# EAGLE design cataclysm-BOTTOM (EAGLE 9.6.1)
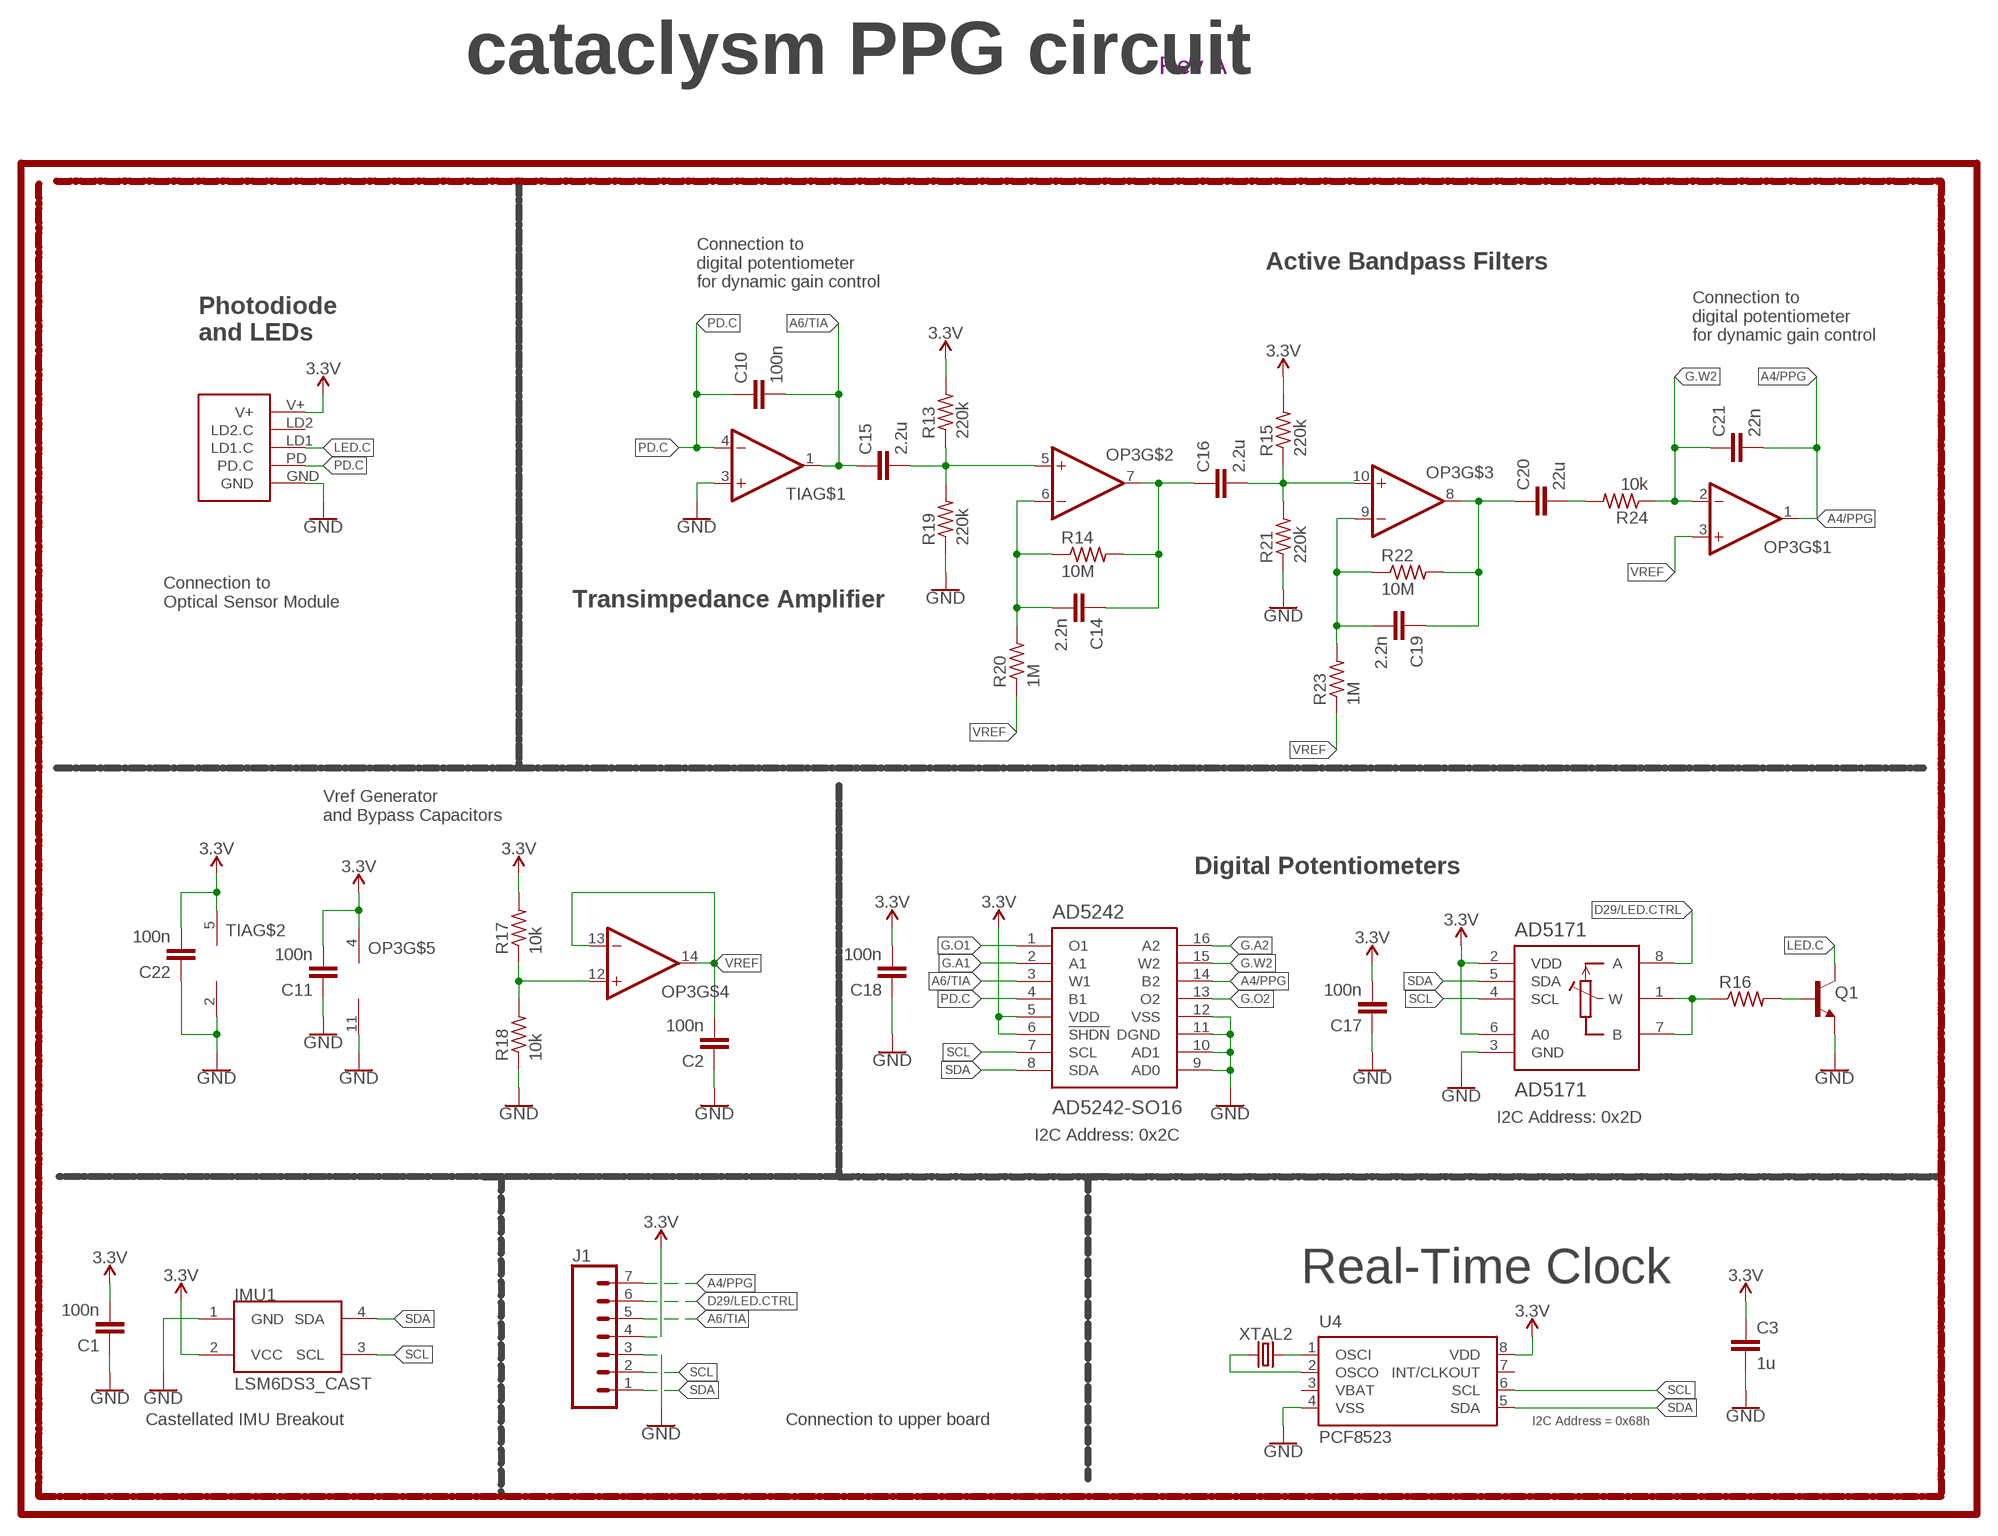
[diagram p0: schematic, sheet 1]

## Parts
AD5171  AD5171  [SOT-23-8]
AD5242  AD5242-SO16  [SO16]
C1  100n  CAPACITOR0603  [C0603]
C2  100n  CAPACITOR0603  [C0603]
C3  1u  CAPACITOR0603  [C0603]
C10  100n  CAPACITOR0603  [C0603]
C11  100n  CAPACITOR0603  [C0603]
C14  2.2n  CAPACITOR0603  [C0603]
C15  2.2u  CAPACITOR0603  [C0603]
C16  2.2u  CAPACITOR0603  [C0603]
C17  100n  CAPACITOR0603  [C0603]
C18  100n  CAPACITOR0603  [C0603]
C19  2.2n  CAPACITOR0603  [C0603]
C20  22u  CAPACITOR0603  [C0603]
C21  22n  CAPACITOR0603  [C0603]
C22  100n  CAPACITOR0603  [C0603]
IMU1  LSM6DS3_CAST  [LSM6DS3_CAST]
J1  CONN_07-1.27MM  [1X07_1.27MM]
LOGO1  REVISION.A  [REV.A]
OP3  OP-QUAD-SO14  [SO14]
Q1  NPN-GENERIC  [SOT23-3]
R13  220k  RESISTOR0603  [R0603]
R14  10M  RESISTOR0603  [R0603]
R15  220k  RESISTOR0603  [R0603]
R16  RESISTOR0603  [R0603]
R17  10k  RESISTOR0402  [R0402]
R18  10k  RESISTOR0402  [R0402]
R19  220k  RESISTOR0603  [R0603]
R20  1M  RESISTOR0603  [R0603]
R21  220k  RESISTOR0603  [R0603]
R22  10M  RESISTOR0603  [R0603]
R23  1M  RESISTOR0603  [R0603]
R24  10k  RESISTOR0603  [R0603]
TIA  OP-SINGLEOT  [SOT23-5]
U4  PCF8523  [SO8]
U$3  PPG.MODULE.2  [PPG.MODULE.2]
XTAL2  32.7680kHz  CRYSTALECS-.327-12.5-12-C-TR  [2-SMD.NOLEAD.2.0MMTO1.2MM]

## Nets
3.3V: AD5171.2(VDD) AD5171.6(A0) AD5242.5(VDD) AD5242.6(!SHDN) C1.2 C3.1 C11.2 C17.2 C18.2 C22.2 IMU1.2(VCC) J1.4 OP3.4(V+) R13.2 R15.2 R17.2 TIA.5(V+) U4.8(VDD) U$3.V+
A4/PPG: AD5242.14(B2) C21.2 J1.7 OP3.1(OUT)
A6/TIA: AD5242.3(W1) C10.2 C15.1 J1.5 TIA.1(OUT)
D29/LED.CTRL: AD5171.8(A) J1.6
G.A1: AD5242.2(A1)
G.A2: AD5242.16(A2)
G.O1: AD5242.1(O1)
G.O2: AD5242.13(O2)
G.W2: AD5242.15(W2) C21.1 OP3.2(-IN) R24.1
GND: AD5171.3(GND) AD5242.9(AD0) AD5242.10(AD1) AD5242.11(DGND) AD5242.12(VSS) C1.1 C2.1 C3.2 C11.1 C17.1 C18.1 C22.1 IMU1.1(GND) J1.3 OP3.11(V-) Q1.2(E) R18.1 R19.1 R21.1 TIA.2(V-) TIA.3(+IN) U4.4(VSS) U$3.GND
LED.C: Q1.3(C) U$3.LD1(LD1.C)
N$1: U4.2(OSCO) XTAL2.P$1
N$8: Q1.1(B) R16.2
N$9: AD5171.1(W) AD5171.7(B) R16.1
N$10: OP3.12(+IN) R17.1 R18.2
N$12: U4.1(OSCI) XTAL2.P$2
N$13: C15.2 OP3.5(+IN) R13.1 R19.2
N$15: C14.2 OP3.6(-IN) R14.1 R20.2
N$16: C14.1 C16.1 OP3.7(OUT) R14.2
N$17: C16.2 OP3.10(+IN) R15.1 R21.2
N$18: C19.2 OP3.9(-IN) R22.1 R23.2
N$19: C19.1 C20.1 OP3.8(OUT) R22.2
N$20: C20.2 R24.2
PD.C: AD5242.4(B1) C10.1 TIA.4(-IN) U$3.PD(PD.C)
SCL: AD5171.4(SCL) AD5242.7(SCL) IMU1.3(SCL) J1.2 U4.6(SCL)
SDA: AD5171.5(SDA) AD5242.8(SDA) IMU1.4(SDA) J1.1 U4.5(SDA)
VREF: C2.2 OP3.3(+IN) OP3.13(-IN) OP3.14(OUT) R20.1 R23.1
Unconnected: U4.7(INT/CLKOUT) U$3.LD2(LD2.C)

## Notes on the sheet
- cataclysm PPG circuit
- Active Bandpass Filters
- Connection to
  digital potentiometer
  for dynamic gain control
- Photodiode
  and LEDs
- Connection to
  digital potentiometer
  for dynamic gain control
- Connection to 
  Optical Sensor Module
- Transimpedance Amplifier
- Vref Generator 
  and Bypass Capacitors
- Digital Potentiometers
- I2C Address: 0x2D
- I2C Address: 0x2C
- Real-Time Clock
- Castellated IMU Breakout | Connection to upper board | I2C Address = 0x68h

## Power pins joined to a net without a drawn wire
VBAT: U4.3(VBAT)

## Library data of the parts
AD5171 = LinnesLab-DigitalIC:AD5171
AD5242 = LinnesLab-DigitalIC:AD5242
C1-C3 C10 C11 C14-C22 = LinnesLab-Passives:CAPACITOR
IMU1 = LinnesLab-Sensors:LSM6DS3_CAST
J1 = LinnesLab-Connectors:CONN_07: Multi connection point. Often used as Generic Header-pin footprint for 0.1 inch spaced/style header connections On any of the 0.1 inch spaced packages, you can populate with these: Break Away Headers - Straight <https://www.sparkfun.com/products/116> (PRT-00116) Break Away Male Headers - Right Angle <https://www.sparkfun.com/products/553> (PRT-00553) Female Headers <https://www.sparkfun.com/products/115> (PRT-00115) Break Away Headers - Machine Pin <https://www.sparkfun.com/products/117> (PRT-00117) Break Away Female Headers - Swiss Machine Pin <https://www.sparkfun.com/products/743> (PRT-00743) For SCREWTERMINALS and SPRING TERMINALS visit here: Screw Terimnals on SparkFun.com <https://www.sparkfun.com/search/results?term=Screw+Terminals> (5mm/3.5mm/2.54mm spacing) This device is also useful as a general connection point to wire up your design to another part of your project. Our various solder wires solder well into these plated through hole pads. Hook-Up Wire - Assortment (Stranded, 22 AWG) <https://www.sparkfun.com/products/11375> (PRT-11375) Hook-Up Wire - Assortment (Solid Core, 22 AWG) <https://www.sparkfun.com/products/11367> (PRT-11367) View the entire wire category on our website here <https://www.sparkfun.com/categories/141> Special notes: Molex polarized connector foot print use with SKU : PRT-08231 with associated crimp pins and housings. 1MM SMD Version SKU: PRT-10208 NOTES ON THE VARIANTS LOCK and LOCK_LONGPADS... This footprint was designed to help hold the alignment of a through-hole component (i.e. 6-pin header) while soldering it into place. You may notice that each hole has been shifted either up or down by 0.005 of an inch from it's more standard position (which is a perfectly straight line). This slight alteration caused the pins (the squares in the middle) to touch the edges of the holes. Because they are alternating, it causes a "brace" to hold the component in place. 0.005 has proven to be the perfect amount of "off-center" position when using our standard breakaway headers. Although looks a little odd when you look at the bare footprint, once you have a header in there, the alteration is very hard to notice. Also,if you push a header all the way into place, it is covered up entirely on the bottom side.
LOGO1 = LinnesLab-Logos:REVISION.A
OP3 = LinnesLab-AnalogIC:OP-QUAD: General symbol and footprints for Quad Op Amps. Use with any standard general purpose op amp.
Q1 = LinnesLab-DiscreteSemi:NPN
R13-R24 = LinnesLab-Passives:RESISTOR
TIA = LinnesLab-AnalogIC:OP-SINGLE: Single Op Amp 2.7V to 6.0V Single Supply CMOS Source: http://ww1.microchip.com/downloads/en/DeviceDoc/21314g.pdf
U4 = LinnesLab-Clocks:PCF8523; DIGIKEY: 568-5306-1-ND; I2C_ADDRESS: 0x68h; MFN: PCF8523T/1,118; MFN_MANUFACTURER: NXP USA Inc.
U$3 = LinnesLab-Connectors:PPG.MODULE.2: Digi-Key Part Number: S9014E-50-ND Manufacturer Part Number: GRPB501VWVN-RC Description: 1mm insulation height 0.05in pitch 50 positions
XTAL2 = LinnesLab-Clocks:CRYSTAL; DIGIKEY: XC2288CT-ND; FREQ: 32.7680KHZ; LOAD_CAP: 12.5pF

## Board
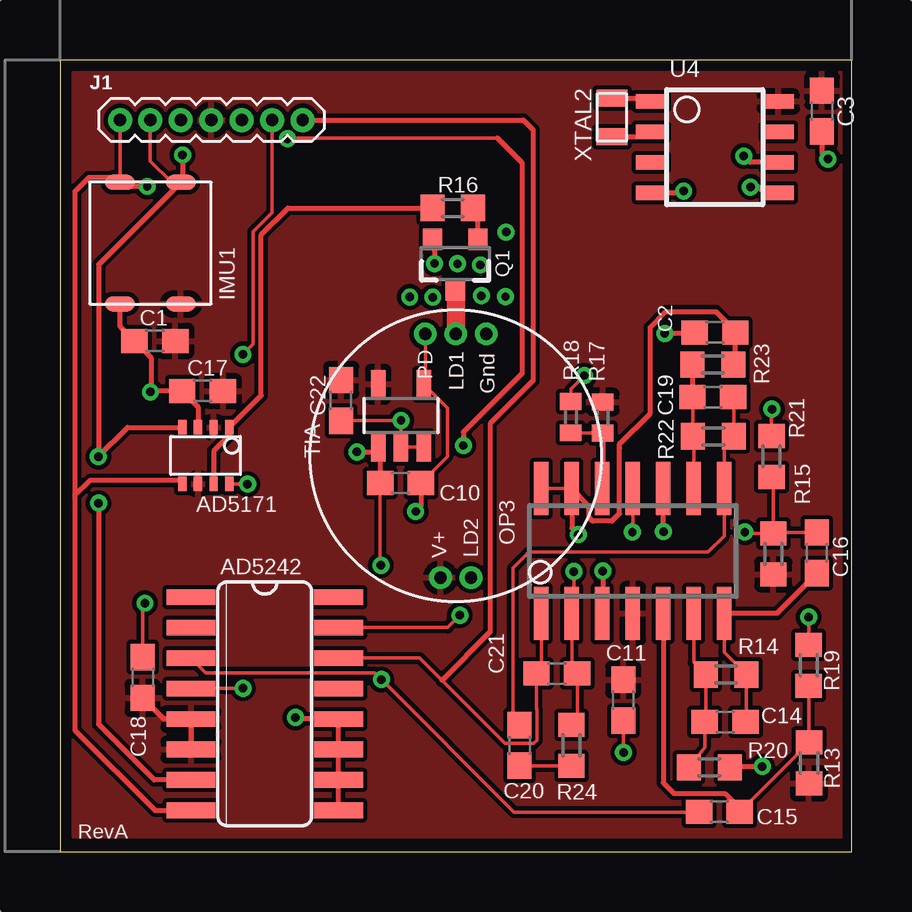
[diagram p1: board, top side]
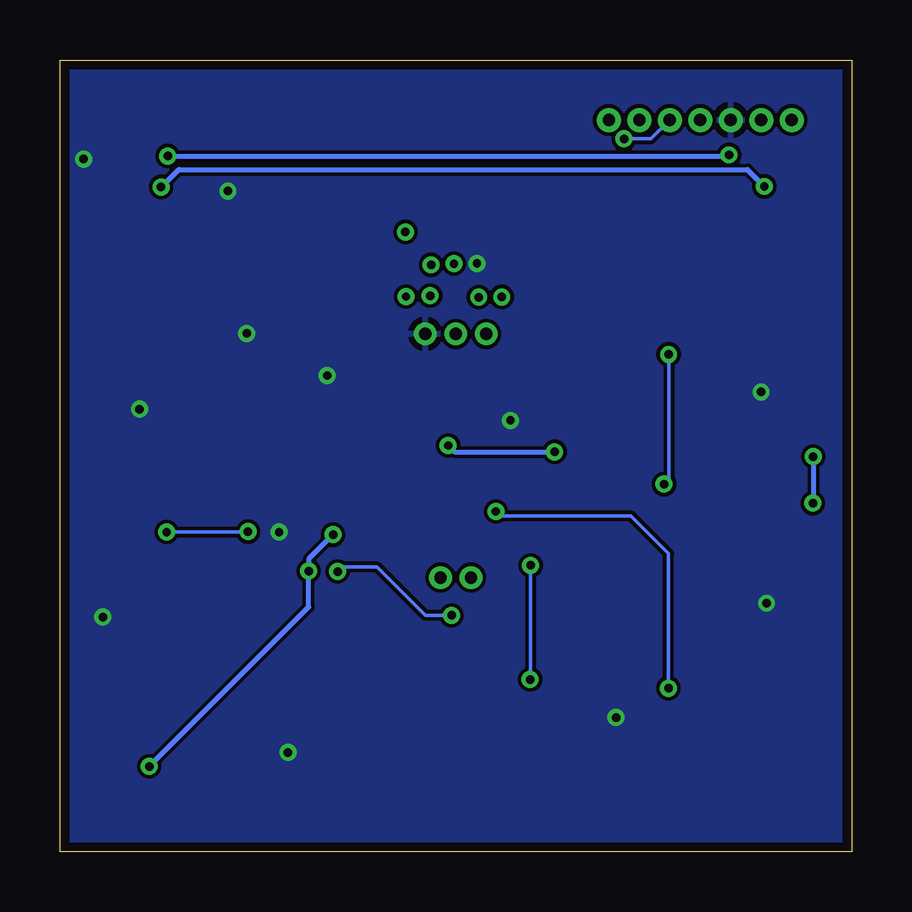
[diagram p2: board, bottom side, seen from below]

Size 33 x 33 mm. Coordinates in mm from the lower left corner, seen from the top.
Outline: 0,0 33,0 33,33 0,33 0,0
Copper layers (1*16): Top 0.0356mm / dielectric 1.5011mm / Bottom 0.0356mm
Design rules "LaenPCBOrder": minimum track width 6mil, minimum drill 13mil, track to track 6mil, track to pad 6mil, pad to pad 6mil, via to via 6mil, smd to smd 6mil, copper to edge 15mil, drill to drill 6mil, minimum pad ring 7mil, minimum via ring 7mil, stop-mask expansion 3mil, vias tented up to drill 0mil, thermal gap 10mil

### Footprints (pad centres in the part's own frame; a part is rotated, then mirrored left to right if it is on the bottom)
SOT-23-8 = smd 0.35 x 0.6: 1 -0.991,-1.176; 2 -0.341,-1.176; 3 0.309,-1.176; 4 0.959,-1.176; 5 0.959,1.176; 6 0.309,1.176; 7 -0.341,1.176; 8 -0.991,1.176
SO16 = smd 0.66 x 2.032: 1 -4.445,-3.073; 2 -3.175,-3.073; 3 -1.905,-3.073; 4 -0.635,-3.073; 5 0.635,-3.073; 6 1.905,-3.073; 7 3.175,-3.073; 8 4.445,-3.073; 9 4.445,3.073; 10 3.175,3.073; 11 1.905,3.073; 12 0.635,3.073; 13 -0.635,3.073; 14 -1.905,3.073; 15 -3.175,3.073; 16 -4.445,3.073
C0603 = smd 1.1 x 1: 1 -0.85,0; 2 0.85,0
LSM6DS3_CAST = smd 0.635 x 1.27: 1 -2.54,1.27; 2 -2.54,-1.27; 3 2.54,-1.27; 4 2.54,1.27
1X07_1.27MM = drill 0.508 pad 1: 1 0,0; 2 1.27,0; 3 2.54,0; 4 3.81,0; 5 5.08,0; 6 6.35,0; 7 7.62,0
SO14 = smd 0.6 x 2.2: 1 -3.81,-2.6; 2 -2.54,-2.6; 3 -1.27,-2.6; 4 0,-2.6; 5 1.27,-2.6; 6 2.54,-2.6; 7 3.81,-2.6; 8 3.81,2.6; 9 2.54,2.6; 10 1.27,2.6; 11 0,2.6; 12 -1.27,2.6; 13 -2.54,2.6; 14 -3.81,2.6
SOT23-3 = smd 0.8 x 0.9: 1 -0.95,-1; 2 0.95,-1; 3 0,1.1
R0603 = smd 1 x 1.1: 1 -0.85,0; 2 0.85,0
R0402 = smd 0.7 x 0.9: 1 -0.65,0; 2 0.65,0
SOT23-5 = smd 0.6 x 1.2: 1 -0.95,-1.306; 2 0,-1.306; 3 0.95,-1.306; 4 0.95,1.306; 5 -0.95,1.306
SO8 = smd 1.3 x 0.6: 1 -2.65,1.905; 2 -2.65,0.635; 3 -2.65,-0.635; 4 -2.65,-1.905; 5 2.65,-1.905; 6 2.65,-0.635; 7 2.65,0.635; 8 2.65,1.905
PPG.MODULE.2 = drill 0.508 pad 0.94: GND 1.27,5.08; LD1 0,5.08; LD2 0.635,-5.08; PD -1.27,5.08; V+ -0.635,-5.08
2-SMD.NOLEAD.2.0MMTO1.2MM = smd 0.7 x 1.3: P$1 -0.8,0; P$2 0.8,0

### Placement (x,y rotation side)
AD5171  6.07,16.51 180 top
AD5242  8.54,6.16 270 top
C1  3.96,21.28 0 top
C2  27.3,21.64 0 top
C3  31.76,30.87 270 top
C10  14.2,15.37 180 top
C11  23.49,6.32 90 top
C14  27.73,5.4 180 top
C15  27.49,1.67 0 top
C16  31.56,12.45 90 top
C17  5.94,19.19 0 top
C18  3.44,7.26 270 top
C19  27.22,18.95 180 top
C20  19.15,4.43 270 top
C21  20.71,7.43 180 top
C22  11.72,18.81 90 top
IMU1  3.77,25.36 90 top
J1  2.5,30.5 0 top
LOGO1  0.75,0.54 0 top
OP3  23.88,12.53 0 top
Q1  16.48,24.51 180 top
R13  31.23,3.69 270 top
R14  27.77,7.38 0 top
R15  29.74,12.4 270 top
R16  16.37,26.83 0 top
R17  22.63,18.09 90 top
R18  21.3,18.11 270 top
R19  31.21,7.76 270 top
R20  27.07,3.51 180 top
R21  29.66,16.47 270 top
R22  27.24,17.31 0 top
R23  27.22,20.3 180 top
R24  21.32,4.43 270 top
TIA  14.22,18.18 0 top
U4  27.3,29.37 0 top
U$3  16.5,16.5 0 top
XTAL2  23.01,30.61 90 top

### Tracks (layer width: path | path; a pad name or v marks a point on that pad's centre or on a via)
3.3V
  Top 0.203: AD5242.6 AD5242.5 4.33,5.52 C18.2
  pour Top (isolate 0.178): 0.55,32.48 32.59,32.48 32.59,0.62 0.55,0.62
A4/PPG
  Top 0.152: OP3.1 20.07,7.64 C21.2 19.86,5.94 19.88,5.92 19.88,4.63 19.75,4.5 18.56,4.5 15.92,7.14 15,8.06 AD5242.14
  Top 0.203: 15.92,7.14 17.93,9.16 17.93,17.84 19.73,19.63 19.73,30.09 19.31,30.5 J1.7
A6/TIA  (via drill 0.35)
  Top 0.152: TIA.1 13.35,16.79 13.35,16.66 | C10.2 13.35,15.29 13.35,11.96 v13.38,11.93 | C15.1 26.61,1.64 18.93,1.64 v13.4,7.17 13.12,7.45 6.08,7.45 AD5242.3 | 18.23,29.75 9.52,29.75 v9.48,29.71
  Top 0.203: 18.23,29.75 19.27,28.71 19.27,19.94 16.81,17.48 v16.81,16.93 | 13.35,15.29 13.35,16.66 13.34,16.66 v12.38,16.66
  Bottom 0.152: v13.38,11.93 13.38,7.19 v13.4,7.17 | v9.48,29.71 8.37,29.71 J1.5
  Bottom 0.203: v16.81,16.93 16.54,16.66 v12.38,16.66
D29/LED.CTRL  (via drill 0.35)
  Top 0.152: J1.6 8.85,26.64 8.06,25.85 8.06,21.16 v7.62,20.73 | v7.81,15.32 7.07,15.32 AD5171.8
  Bottom 0.152: v7.62,20.73 7.62,15.51 v7.81,15.32
G.W2  (via drill 0.35)
  Top 0.152: R24.1 21.56,5.52 C21.1 21.34,7.65 OP3.2 21.42,10.01 v21.42,11.67 | v16.67,9.85 16.16,9.33 AD5242.15
  Bottom 0.152: v16.67,9.85 17.77,9.85 19.78,11.86 21.24,11.86 v21.42,11.67
GND  (via drill 0.35)
  Top 0.152: R18.1 21.3,19.28 v21.86,19.84 | OP3.11 23.88,13.33 v23.86,13.32 | R21.1 29.66,18.43 v29.68,18.45 | R19.1 v31.21,9.78 | C11.1 v23.49,4.13 | v14.22,17.97 TIA.2 TIA.3 | v14.22,17.97 v14.22,17.98 | C22.1 v14.22,17.97 | C18.1 3.44,10.26 v3.54,10.36
  Top 0.2: C2.1 26.41,21.6 v25.21,21.6 | C3.2 31.76,29.13 v32.02,28.87 | U4.4 25.93,27.46 v26,27.54
  Top 0.203: C1.1 2.5,21.89 IMU1.1 | 5.77,17.67 AD5171.3 5.76,18.53 C17.1 3.8,19.19 | 3.8,19.19 v3.77,19.16 | Q1.2 15.61,25.43 v15.61,24.52 | v9.82,5.59 9.88,5.52 AD5242.12 AD5242.11 AD5242.10 AD5242.9 | C1.1 | C1.1 3.8,20.59 3.8,19.19
  Top 0.762: Q1.2
  pour Bottom: 0.34,32.86 32.82,32.86 32.82,0.28 0.34,0.28
LED.C
  Top 0.762: Q1.3 16.5,23.39 U$3.LD1
N$1
  Top 0.2: XTAL2.P$1 24.46,29.81 U4.2
N$2  (via drill 0.35)
  other vias: 14.58,23.12
N$3  (via drill 0.35)
  other vias: 15.54,23.11
N$4  (via drill 0.35)
  other vias: 17.57,23.17
N$5  (via drill 0.35)
  other vias: 18.57,23.14
N$6  (via drill 0.35)
  other vias: 18.6,25.83
N$7  (via drill 0.35)
  other vias: 16.57,24.51
N$8
  Top 0.203: Q1.1 17.43,26.62 R16.2
N$9
  Top 0.203: R16.1 9.5,26.83 8.39,25.71 8.39,19.02 AD5171.1 7.06,17.34 6.41,16.7 AD5171.7
N$10
  Top 0.152: R18.2 22.61,17.46 R17.1
  Top 0.2: R17.1 22.63,15.15 OP3.12
N$11  (via drill 0.35)
  other vias: 17.53,24.46
N$12
  Top 0.2: XTAL2.P$2 24.52,31.41 U4.1
N$13
  Top 0.152: R19.2 31.23,6.9 R13.1 28.41,1.72 | C15.2 28.34,1.79
  Top 0.203: OP3.5 25.15,2.87 25.6,2.42 27.71,2.42 28.34,1.79 28.41,1.72
N$15
  Top 0.152: OP3.6 26.42,7.88 R14.1 26.92,5.44 C14.2 26.88,4.34 R20.2
N$16
  Top 0.152: OP3.7 27.69,8.31 R14.2 28.62,5.44 C14.1
  Top 0.203: C16.1 29.89,9.93 OP3.7
N$17  (via drill 0.35)
  Top 0.152: C16.2 29.79,13.3 R15.1 | R15.1 29.74,15.54 R21.2 | R15.1 28.62,13.26 v28.55,13.32
  Top 0.2: v25.16,13.34 25.16,15.12 OP3.10
  Bottom 0.152: v28.55,13.32 25.18,13.32 v25.16,13.34
N$18
  Top 0.152: OP3.9 26.42,17.28 R22.1 26.39,18.92 C19.2
  Top 0.203: C19.2 R23.2
N$19
  Top 0.152: C20.1 18.89,5.55 18.89,11.81 19.55,12.48 27.01,12.48 27.69,13.16 OP3.8 27.69,16.91 R22.2 28.09,18.92 C19.1
N$20
  Top 0.152: 21.2,3.58 R24.2 | C20.2 21.2,3.58 | 21.2,3.58
PD.C  (via drill 0.35)
  Top 0.152: U$3.PD 15.23,19.55 TIA.4 16.15,18.5 16.15,16.48 C10.1 | v7.63,6.81 7.62,6.79 AD5242.4
  Top 0.203: C10.1 15.05,14.4 v14.82,14.18
  Bottom 0.152: v14.82,14.18 14.64,14 9.21,14 7.63,12.42 v7.63,6.81
SCL  (via drill 0.35)
  Top 0.152: J1.2 3.77,28.79 4.66,27.9 IMU1.3
  Top 0.2: U4.6 28.77,28.73 v28.51,29 | v5.11,29.04 5.11,27.97 5,27.87
  Top 0.203: AD5242.7 3.92,2.98 1.61,5.3 1.61,14.52 v1.61,14.53 | IMU1.3 5,27.87 1.61,24.48 1.61,16.48 v1.6,16.46 2.82,17.69 AD5171.4
  Bottom 0.2: v28.51,29 5.15,29 v5.11,29.04
  Bottom 0.203: v1.61,14.53 1.6,14.53 v1.6,16.46
SDA  (via drill 0.35)
  Top 0.152: IMU1.4 J1.1
  Top 0.2: U4.5 29.37,27.46 29.13,27.7 v28.79,27.7 | v3.63,27.73 2.68,27.73 IMU1.4
  Top 0.203: IMU1.4 2.31,28.1 1.2,28.1 0.62,27.52 0.62,14.83 | AD5242.8 3.96,1.71 0.62,5.06 0.62,14.83 | AD5171.5 4.96,15.48 1.26,15.48 0.62,14.83
  Bottom 0.2: v28.79,27.7 28.05,28.44 4.34,28.44 v3.63,27.73
VREF  (via drill 0.35)
  Top 0.152: OP3.14 OP3.13
  Top 0.2: C2.2 28.15,21.93 28.14,21.93 | 28.14,21.93 28.14,20.38 R23.1 | 23.33,16.81 23.33,16.98 24.61,18.26 24.61,21.85 25.26,22.51 27.35,22.51 27.93,21.93 28.14,21.93
  Top 0.203: 23.33,16.81 23.33,14.09 23.02,13.77 22.2,13.77 22.06,13.92 22.06,14.41 OP3.13 21.34,13.48 v21.61,13.21 | R20.1 27.96,3.55 v29.28,3.55 | v22.63,11.69 22.63,9.95 OP3.3
  Bottom 0.203: v29.28,3.55 22.63,10.19 v22.63,11.69 22.63,12.19 v21.61,13.21